# Altium project nova34.PrjPcb (part 3 of 3)
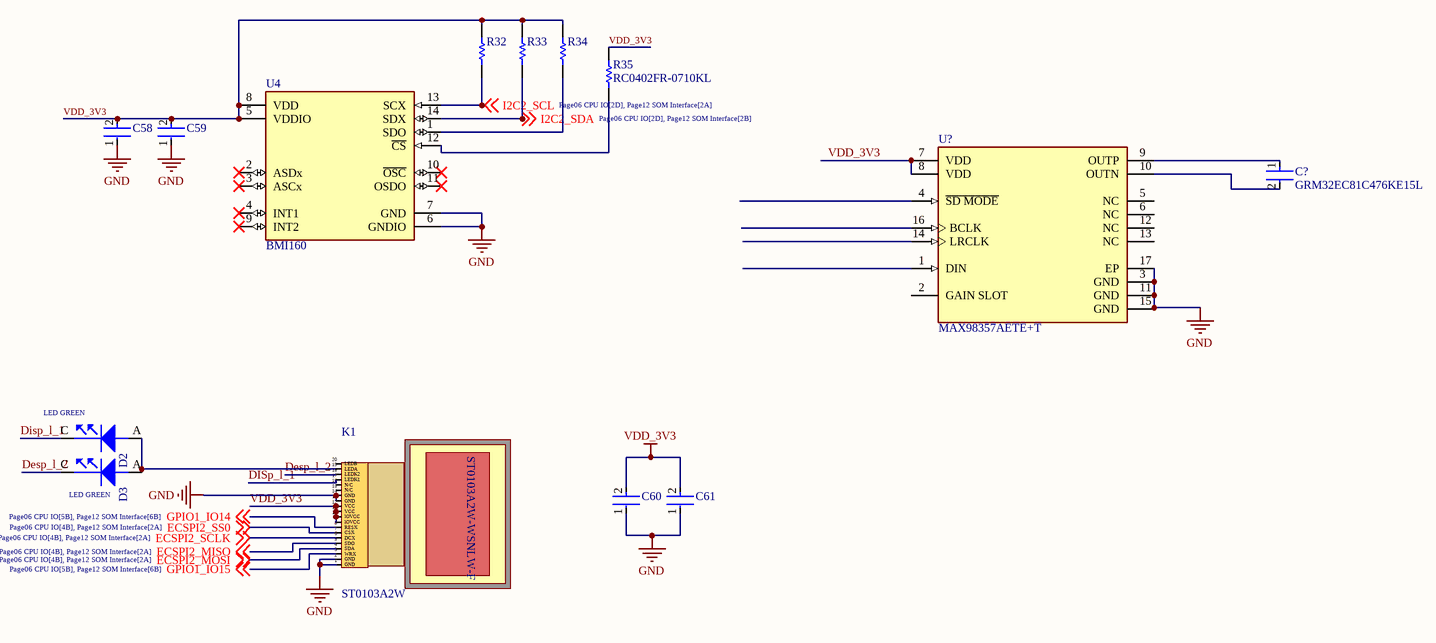
[diagram p13: Page13 IMU_DISPLAY.SchDoc]

## Nets that join several sheets
GND: Page04 CPU PWR (97 pins), Page05 DDR4L+eMMC (76 pins), Page06 CPU IO (C245.2 Q1.2 U12.2 U12.3), Page07 CPU PHY (5 pins), Page08 CPU MISC (7 pins), Page09 WIFI&Bluetooth (22 pins), Page11 PMIC PCA9450B (36 pins), Page12 SOM Interface (56 pins), Page13 IMU_DISPLAY (14 pins)
NVCC_DRAM: Page05 DDR4L+eMMC (22 pins), Page09 WIFI&Bluetooth (11 pins)
NVCC_DRAM_1V35: Page04 CPU PWR (17 pins), Page11 PMIC PCA9450B (C318.1 L15.2 TP27.1 U8.52)
NVCC_ENET: Page04 CPU PWR (C392.1 R216.1 U1.R12), Page05 DDR4L+eMMC (R6.1), Page06 CPU IO (R218.1 R219.2 U12.5), Page12 SOM Interface (C2.1 J7N.19)
NVCC_SD2: Page04 CPU PWR (C17.1 U1.R16), Page06 CPU IO (R119.1 R120.1 R133.1), Page11 PMIC PCA9450B (C365.1 TP33.1 U8.55)
NVCC_SNVS_1V8: Page04 CPU PWR (C391.1 U1.G14), Page08 CPU MISC (R20.1 R21.1 R102.1 R217.1), Page11 PMIC PCA9450B (C333.1 TP28.1 U8.3)
USB1_VBUS: Page07 CPU PHY (C393.1 R108.2 V-USB.1), Page12 SOM Interface (J4N.81)
VDD_1V8: Page04 CPU PWR (10 pins), Page05 DDR4L+eMMC (16 pins), Page06 CPU IO (8 pins), Page07 CPU PHY (J1.10 J1.11 J1.23), Page09 WIFI&Bluetooth (C146.1 U2.A1), Page10 BOOT_CFG (R47.2 R77.2 R78.2 R79.2), Page11 PMIC PCA9450B (8 pins), Page12 SOM Interface (9 pins)
VDD_3V3: Page04 CPU PWR (8 pins), Page05 DDR4L+eMMC (20 pins), Page06 CPU IO (R125.1), Page07 CPU PHY (J1.4), Page09 WIFI&Bluetooth (16 pins), Page11 PMIC PCA9450B (9 pins), Page12 SOM Interface (9 pins), Page13 IMU_DISPLAY (16 pins)
VDD_PHY_1V2: Page04 CPU PWR (C244.1 U1.F12), Page11 PMIC PCA9450B (C351.1 TP31.1 U8.1)
VDD_SNVS_0V8: Page04 CPU PWR (C9.1 U1.J15), Page08 CPU MISC (R113.1), Page11 PMIC PCA9450B (C337.1 TP29.1 U8.2)
VDD_SOC_0V9: Page04 CPU PWR (32 pins), Page11 PMIC PCA9450B (9 pins)
VDDA_1V8: Page04 CPU PWR (8 pins), Page11 PMIC PCA9450B (C363.1 TP32.1 U8.54)
VSYS_5V: Page11 PMIC PCA9450B (23 pins), Page12 SOM Interface (11 pins)
BOOT_MODE0: Page08 CPU MISC (U1.G16), Page10 BOOT_CFG (R47.1), Page12 SOM Interface (J4N.98)
BOOT_MODE1: Page08 CPU MISC (U1.G18), Page10 BOOT_CFG (R79.1), Page12 SOM Interface (J4N.100)
BOOT_MODE2: Page08 CPU MISC (U1.F16), Page10 BOOT_CFG (R78.1), Page12 SOM Interface (J4N.60)
BOOT_MODE3: Page08 CPU MISC (U1.G17), Page10 BOOT_CFG (R77.1), Page12 SOM Interface (J4N.56)
BT_CTS: Page06 CPU IO (U1.B10), Page09 WIFI&Bluetooth (R30.2)
BT_RXD: Page06 CPU IO (TX1.1 U1.E10), Page09 WIFI&Bluetooth (R28.2)
BT_TXD: Page06 CPU IO (RX1.1 U1.A9), Page09 WIFI&Bluetooth (R31.2)
BT_WAKE_HOST: Page06 CPU IO (U1.R20), Page09 WIFI&Bluetooth (U9.18 U9.19)
CLK_32K_OUT: Page08 CPU MISC (R100.1), Page11 PMIC PCA9450B (U8.7)
CLKIN1: Page08 CPU MISC (tp20.1 U1.E20), Page12 SOM Interface (J4N.94)
CLKIN2: Page08 CPU MISC (TP21.1 U1.F20), Page12 SOM Interface (J4N.96)
CLKOUT1: Page08 CPU MISC (U1.E21), Page12 SOM Interface (J4N.64)
CLKOUT2: Page08 CPU MISC (U1.F21), Page12 SOM Interface (J4N.66)
CSI_CKN: Page07 CPU PHY (U1.A13), Page12 SOM Interface (J4N.45)
CSI_CKP: Page07 CPU PHY (J1.13 U1.B13), Page12 SOM Interface (J4N.47)
CSI_DN0: Page07 CPU PHY (J1.18 U1.A11), Page12 SOM Interface (J4N.33)
CSI_DN1: Page07 CPU PHY (J1.14 U1.A12), Page12 SOM Interface (J4N.39)
CSI_DN2: Page07 CPU PHY (J1.22 U1.A14), Page12 SOM Interface (J4N.51)
CSI_DN3: Page07 CPU PHY (U1.A15), Page12 SOM Interface (J4N.57)
CSI_DP0: Page07 CPU PHY (J1.16 U1.B11), Page12 SOM Interface (J4N.35)
CSI_DP1: Page07 CPU PHY (J1.12 U1.B12), Page12 SOM Interface (J4N.41)
CSI_DP2: Page07 CPU PHY (J1.20 U1.B14), Page12 SOM Interface (J4N.53)
CSI_DP3: Page07 CPU PHY (U1.B15), Page12 SOM Interface (J4N.59)
ECSPI2_MISO: Page06 CPU IO (U1.B5), Page12 SOM Interface (J4N.16), Page13 IMU_DISPLAY (K1.5)
ECSPI2_MOSI: Page06 CPU IO (U1.A6), Page12 SOM Interface (J4N.18), Page13 IMU_DISPLAY (K1.4)
ECSPI2_SCLK: Page06 CPU IO (U1.A4), Page12 SOM Interface (J4N.14), Page13 IMU_DISPLAY (K1.6)
ECSPI2_SS0: Page06 CPU IO (U1.A5), Page12 SOM Interface (J4N.12), Page13 IMU_DISPLAY (K1.7)
ENET_MDC: Page06 CPU IO (U1.Y18), Page12 SOM Interface (J7N.18)
ENET_MDIO: Page06 CPU IO (U1.T16), Page12 SOM Interface (J7N.20)
ENET_RD0: Page06 CPU IO (U1.AA19), Page12 SOM Interface (J7N.8)
ENET_RD1: Page06 CPU IO (U1.Y15), Page12 SOM Interface (J7N.10)
ENET_RD2: Page06 CPU IO (U1.Y16), Page12 SOM Interface (J7N.12)
ENET_RD3: Page06 CPU IO (U1.AA16), Page12 SOM Interface (J7N.14)
ENET_RX_CTL: Page06 CPU IO (U1.V16), Page12 SOM Interface (J7N.2)
ENET_RXC: Page06 CPU IO (U1.U16), Page12 SOM Interface (J7N.4)
ENET_TD0: Page06 CPU IO (U1.U18), Page12 SOM Interface (J7N.9)
ENET_TD1: Page06 CPU IO (U1.AA18), Page12 SOM Interface (J7N.11)
ENET_TD2: Page06 CPU IO (U1.V18), Page12 SOM Interface (J7N.13)
ENET_TD3: Page06 CPU IO (U1.AA17), Page12 SOM Interface (J7N.15)
ENET_TX_CTL: Page06 CPU IO (U1.Y17), Page12 SOM Interface (J7N.1)
ENET_TXC: Page06 CPU IO (U1.Y19), Page12 SOM Interface (J7N.5)
GPIO1_IO01: Page06 CPU IO (U1.R8), Page12 SOM Interface (J5N.64)
GPIO1_IO05: Page06 CPU IO (U1.T8), Page12 SOM Interface (J5N.62)
GPIO1_IO06: Page06 CPU IO (U1.Y8), Page12 SOM Interface (J5N.58)
GPIO1_IO07: Page06 CPU IO (U1.U8), Page12 SOM Interface (J5N.56)
GPIO1_IO08: Page06 CPU IO (U1.V10), Page12 SOM Interface (J5N.54)
GPIO1_IO09: Page06 CPU IO (U1.AA9), Page12 SOM Interface (J5N.52)
GPIO1_IO10: Page06 CPU IO (U1.AA10), Page12 SOM Interface (J5N.50)
GPIO1_IO11: Page06 CPU IO (U1.Y11), Page12 SOM Interface (J5N.46)
GPIO1_IO12: Page06 CPU IO (U1.U10), Page12 SOM Interface (J5N.44)
GPIO1_IO13: Page06 CPU IO (U1.T10), Page12 SOM Interface (J5N.42)
GPIO1_IO14: Page06 CPU IO (U1.Y10), Page12 SOM Interface (J5N.40), Page13 IMU_DISPLAY (K1.8)
GPIO1_IO15: Page06 CPU IO (U1.AA11), Page12 SOM Interface (J5N.38), Page13 IMU_DISPLAY (K1.3)
I2C1_SCL: Page06 CPU IO (R10.2 U1.B7), Page11 PMIC PCA9450B (R48.1)
I2C1_SDA: Page06 CPU IO (R11.2 U1.A7), Page11 PMIC PCA9450B (R54.1)
I2C2_SCL: Page06 CPU IO (R12.2 U1.F10), Page12 SOM Interface (J4N.22), Page13 IMU_DISPLAY (R32.1 U4.13)
I2C2_SDA: Page06 CPU IO (R13.2 U1.D8), Page12 SOM Interface (J4N.24), Page13 IMU_DISPLAY (R33.1 U4.14)
I2C3_SCL: Page06 CPU IO (R14.2 U1.F8), Page07 CPU PHY (J1.5), Page12 SOM Interface (J4N.26)
I2C3_SDA: Page06 CPU IO (R15.2 U1.E8), Page07 CPU PHY (J1.3), Page12 SOM Interface (J4N.28)
I2C4_SCL: Page06 CPU IO (R16.2 U1.B8), Page12 SOM Interface (J4N.30)
I2C4_SDA: Page06 CPU IO (R17.2 U1.A8), Page12 SOM Interface (J4N.34)
JTAG_TCK: Page08 CPU MISC (R18.1 TP4.1 U1.D21), Page12 SOM Interface (J4N.62)
JTAG_TDI: Page08 CPU MISC (U1.C21), Page12 SOM Interface (J4N.54)
JTAG_TDO: Page08 CPU MISC (U1.D20), Page12 SOM Interface (J4N.52)
JTAG_TMS: Page08 CPU MISC (R27.2), Page12 SOM Interface (J4N.58)
ONOFF: Page08 CPU MISC (R21.2 TP7.1 U1.E14), Page12 SOM Interface (J4N.46)
PDM_CLK: Page06 CPU IO (U1.V14), Page12 SOM Interface (J5N.65)
PDM_DATA0: Page06 CPU IO (U1.U12), Page12 SOM Interface (J5N.67)
PDM_DATA1: Page06 CPU IO (U1.T14), Page12 SOM Interface (J5N.69)
PDM_DATA2: Page06 CPU IO (U1.V12), Page12 SOM Interface (J5N.71)
PDM_DATA3: Page06 CPU IO (U1.U14), Page12 SOM Interface (J5N.73)
PMIC_nINT: Page06 CPU IO (U1.Y9), Page11 PMIC PCA9450B (R61.1 U8.13)
PMIC_ON_REQ: Page08 CPU MISC (R217.2 TP6.1 U1.E16), Page11 PMIC PCA9450B (R51.1), Page12 SOM Interface (J4N.48)
PMIC_STBY_REQ: Page08 CPU MISC (TP10.1 U1.A19), Page11 PMIC PCA9450B (R52.1)
PMIC_WDOG_B: Page06 CPU IO (R219.1 R220.2 U12.4), Page11 PMIC PCA9450B (R55.1 TP53.1)
POR_B: Page08 CPU MISC (R20.2 TP9.1 U1.A18), Page11 PMIC PCA9450B (R114.2), Page12 SOM Interface (J4N.50)
REF_CLK_32K: Page06 CPU IO (U1.V8), Page12 SOM Interface (R116.1)
RTC_RESET_B: Page08 CPU MISC (R102.2 TP8.1 U1.B18), Page11 PMIC PCA9450B (R111.2)
SAI2_MCLK: Page06 CPU IO (U1.Y12), Page12 SOM Interface (J5N.66)
SAI2_RXC: Page06 CPU IO (U1.AA15), Page12 SOM Interface (J5N.79)
SAI2_RXD: Page06 CPU IO (U1.AA14), Page09 WIFI&Bluetooth (R9.2)
SAI2_RXFS: Page06 CPU IO (U1.Y13), Page12 SOM Interface (J5N.68)
SAI2_TXC: Page06 CPU IO (U1.AA13), Page09 WIFI&Bluetooth (R22.2), Page11 PMIC PCA9450B (R198.1)
SAI2_TXC_3P3: Page11 PMIC PCA9450B (R203.1), Page12 SOM Interface (J5N.87)
SAI2_TXD: Page06 CPU IO (U1.Y14), Page09 WIFI&Bluetooth (R8.2), Page11 PMIC PCA9450B (R199.1)
SAI2_TXD_3P3: Page11 PMIC PCA9450B (R202.1), Page12 SOM Interface (J5N.91)
SAI2_TXFS: Page06 CPU IO (U1.AA12), Page09 WIFI&Bluetooth (R19.2)
SAI3_MCLK: Page06 CPU IO (U1.AA5), Page12 SOM Interface (J5N.41)
SAI3_RXC: Page06 CPU IO (U1.Y6), Page12 SOM Interface (J5N.53)
SAI3_RXD: Page06 CPU IO (U1.AA6), Page12 SOM Interface (J5N.55)
SAI3_RXFS: Page06 CPU IO (U1.Y4), Page12 SOM Interface (J5N.51)
SAI3_TXC: Page06 CPU IO (U1.Y5), Page12 SOM Interface (J5N.45)
SAI3_TXD: Page06 CPU IO (U1.AA4), Page12 SOM Interface (J5N.49)
SAI3_TXFS: Page06 CPU IO (U1.Y7), Page12 SOM Interface (J5N.43)
SAI5_MCLK: Page06 CPU IO (U1.W11), Page12 SOM Interface (J5N.77)
SAI5_RXFS: Page06 CPU IO (U1.T12), Page12 SOM Interface (J5N.70)
SD1_CLK: Page06 CPU IO (U1.R21), Page09 WIFI&Bluetooth (U9.31)
SD1_CMD: Page06 CPU IO (U1.T21), Page09 WIFI&Bluetooth (U9.32)
SD1_DATA0: Page06 CPU IO (U1.N18), Page09 WIFI&Bluetooth (U9.30)
SD1_DATA1: Page06 CPU IO (U1.N17), Page09 WIFI&Bluetooth (U9.29)
SD1_DATA2: Page06 CPU IO (U1.N21), Page09 WIFI&Bluetooth (U9.34)
SD1_DATA3: Page06 CPU IO (U1.P20), Page09 WIFI&Bluetooth (U9.33)
SD1_STROBE: Page06 CPU IO (U1.R17), Page12 SOM Interface (J4N.70)
SD2_CLK: Page06 CPU IO (U1.Y21), Page12 SOM Interface (J4N.76)
SD2_CMD: Page06 CPU IO (R120.2 U1.V21), Page12 SOM Interface (J4N.78)
SD2_DATA0: Page06 CPU IO (R119.2 U1.AA20), Page12 SOM Interface (J4N.84)
SD2_DATA1: Page06 CPU IO (U1.U21), Page12 SOM Interface (J4N.82)
SD2_DATA2: Page06 CPU IO (U1.W20), Page12 SOM Interface (J4N.72)
SD2_DATA3: Page06 CPU IO (U1.V20), Page12 SOM Interface (J4N.74)
SD2_nCD: Page06 CPU IO (U1.U20), Page12 SOM Interface (J4N.88)
SD2_nRST: Page06 CPU IO (R133.2 U1.Y20), Page12 SOM Interface (J4N.90)
SD2_VSEL: Page06 CPU IO (U1.AA7), Page11 PMIC PCA9450B (U8.29)
SD2_WP: Page06 CPU IO (U1.W21), Page12 SOM Interface (J4N.86)
SD3_CLK: Page05 DDR4L+eMMC (CLKm.1 U3.A10), Page06 CPU IO (U1.J16)
SD3_CMD: Page05 DDR4L+eMMC (CMDm.1 R3.2 U3.B17), Page06 CPU IO (U1.J21)
SD3_DATA0: Page05 DDR4L+eMMC (DAT0m.1 R5.2 U3.A9), Page06 CPU IO (U1.L18)
SD3_DATA1: Page05 DDR4L+eMMC (U3.B7), Page06 CPU IO (U1.J18)
SD3_DATA2: Page05 DDR4L+eMMC (U3.B12), Page06 CPU IO (U1.N20)
SD3_DATA3: Page05 DDR4L+eMMC (U3.B13), Page06 CPU IO (U1.G20)
SD3_DATA4: Page05 DDR4L+eMMC (U3.B8), Page06 CPU IO (U1.G21)
SD3_DATA5: Page05 DDR4L+eMMC (U3.A7), Page06 CPU IO (U1.L16)
SD3_DATA6: Page05 DDR4L+eMMC (U3.A12), Page06 CPU IO (U1.L20)
SD3_DATA7: Page05 DDR4L+eMMC (U3.A14), Page06 CPU IO (U1.K20)
SD3_STROBE: Page05 DDR4L+eMMC (DSm.1 U3.B15), Page06 CPU IO (U1.H20)
SPDIF_EXT_CLK: Page06 CPU IO (U1.T6), Page12 SOM Interface (J5N.63)
SPDIF_RX: Page06 CPU IO (U1.U6), Page12 SOM Interface (J5N.59)
SPDIF_TX: Page06 CPU IO (U1.V6), Page12 SOM Interface (J5N.57)
SYS_nRST: Page11 PMIC PCA9450B (R127.1), Page12 SOM Interface (J5N.39)
UART2_RXD: Page06 CPU IO (U1.B9), Page12 SOM Interface (J4N.36)
UART2_TXD: Page06 CPU IO (U1.C11), Page12 SOM Interface (J4N.38)
UART3_CTS: Page06 CPU IO (U1.D6), Page12 SOM Interface (J4N.10)
UART3_RTS: Page06 CPU IO (U1.B6), Page12 SOM Interface (J4N.2)
UART3_RXD: Page06 CPU IO (U1.E6), Page12 SOM Interface (J4N.4)
UART3_TXD: Page06 CPU IO (U1.F6), Page12 SOM Interface (J4N.6)
UART4_RXD: Page06 CPU IO (U1.A10), Page12 SOM Interface (J4N.40)
UART4_TXD: Page06 CPU IO (U1.D10), Page12 SOM Interface (J4N.42)
USB1_DN: Page07 CPU PHY (D-N.1 U1.A17), Page12 SOM Interface (J4N.83)
USB1_DP: Page07 CPU PHY (D-P.1 U1.B17), Page12 SOM Interface (J4N.85)
USB1_ID: Page07 CPU PHY (U1.D14 USB-ID.1), Page12 SOM Interface (J4N.89)
WL_WAKE_HOST: Page06 CPU IO (U1.N16), Page09 WIFI&Bluetooth (U9.20)